# Altium schematic sheet EEPROM.SchDoc: EEPROM
size 420 x 297 mm; Author: P. Zdunek; DrawnBy: P. Zdunek; Organization: Altium Limited; Address1: L3, 12a Rodborough Rd; Address2: Frenchs Forest; Address3: NSW; Address4: Australia 2086; DocumentNumber: 16; SheetNumber: 16; SheetTotal: 37; ModifiedBy: -; CheckedDate: -; Title2: Fast Stabilizer; DivGrp: WUT ISE; Designer: G.Kasprowicz
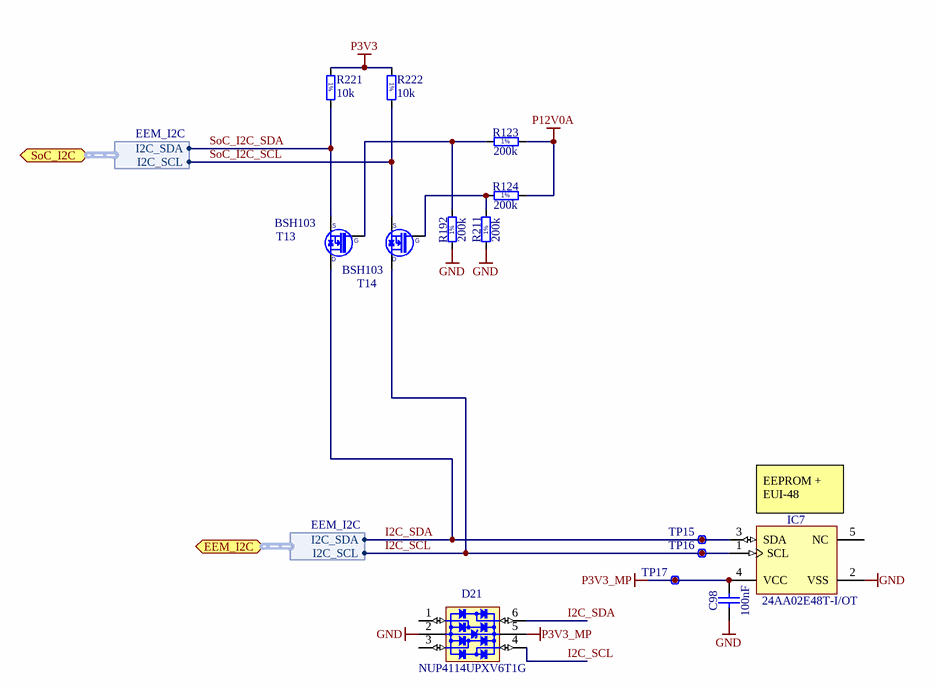
[diagram p0: EEPROM.SchDoc]

## Parts
C98  100nF  [CAPC1005X55N]
D21  NUP4114UPXV6T1G  [SOTFL50P160X60-6N]
IC7  24AA02E48T-I/OT  [SOT95P280X145-5N]
R123  200k  [RESC1005X40N]
R124  200k  [RESC1005X40N]
R192  200k  [RESC1005X40N]
R211  200k  [RESC1005X40N]
R221  10k  [RESC1005X40N]
R222  10k  [RESC1005X40N]
T13  BSH103  [SOT95P230X110-3N]
T14  BSH103  [SOT95P230X110-3N]
TP15  Test Point  [TPS127]  (value not drawn)  (no BOM)
TP16  Test Point  [TPS127]  (value not drawn)  (no BOM)
TP17  Test Point  [TPS127]  (value not drawn)  (no BOM)

## Ports
EEM_I2C (bidir, harness EEM_I2C), SoC_I2C (bidir, harness EEM_I2C)

## Harnesses
EEM_I2C: I2C_SCL, I2C_SDA

## Nets
GND: C98.1 D21.2(GND) IC7.2(VSS) R192.1 R211.1
P3V3: R221.1 R222.1
P3V3_MP: C98.2 D21.5(VBUS) IC7.4(VCC) TP17.1
P12V0A: R123.2 R124.2
I2C_SCL: D21.4(I/O3) IC7.1(SCL) T14.3(D) TP16.1 ; port EEM_I2C.I2C_SCL
I2C_SDA: D21.6(I/O4) IC7.3(SDA) T13.3(D) TP15.1 ; port EEM_I2C.I2C_SDA
SoC_I2C_SCL: R222.2 T14.2(S) ; port SoC_I2C.I2C_SCL
SoC_I2C_SDA: R221.2 T13.2(S) ; port SoC_I2C.I2C_SDA
NetR123_1: R123.1 R192.2 T13.1(G)
NetR124_1: R124.1 R211.2 T14.1(G)

Not connected (* = marked no-connect by the designer): D21 1(I/O1) 3(I/O2); IC7 5(NC)

## Notes on the sheet
- (near IC7) EEPROM + EUI-48
- Project/Equipment
- Document
- Designer
- Drawn by
- Check.by
- Copyright WUT ISE 2020.
  This documentation describes Open Hardware and is licensed under the CERN OHL v.1.2. You may redistribute and modify this documentation under the terms of the CERN OHL v.1.2. (http://ohwr.org/CERNOHL). This documentation is distributed WITHOUT ANY EXPRESS OR IMPLIED WARRANTY, INCLUDING OF MERCHANTABILITY, SATISFACTORY QUALITY AND FITNESS FOR A PARTICULAR PURPOSE. Please see the CERN OHL v.1.2 for applicable conditions.
- Contact
- File
- Last Mod.
- Print Date
- Sheet
- Size
- A3
- of
- Rev
- (in symbol R0402_10K_1%_0.0625W_100PPM) 1%
- (in symbol R0402_200K_1%_0.0625W_100PPM) 1%

## Library data of the parts
C98 = CC0402_100NF_16V_10%_X5R: Non-polarised capacitor; Part Description: SMD Multilayer Chip Ceramic Capacitor; Manufacturer: GENERIC; Manufacturer1 Part Number: GRM155R61C104KA88D; Voltage: 16V; TC: X5R; Tolerance: ±10%; Part Number: CC0402_100NF_16V_10%_X5R; Component Kind: Standard; Component Type: Standard; Pin Count: 2; Value: 100nF; Status: None; Manufacturer Part Number: CC0402_100NF_16V_10%_X5R; Case: 0402; Mounted: Yes; Socket: No; SMD: Yes; Sense: No; Manufacturer1 Example: MURATA; Manufacturer1 ComponentHeight: 0.55mm; HelpURL: \\cern.ch\dfs\Applications\Altium\Datasheets\CC0402_X5R_MURATA_GRM.pdf; Author: CERN DEM JLC; CreateDate: 10.12.2013; LatestRevisionDate: 10.12.2013
D21 = NUP4114UPXV6T1G: Part Description: ESD Protection Diodes Array (8kV) with Low Clamping Voltage; Manufacturer: ON SEMICONDUCTOR; Voltage: 5.5V; PressFit: No; Bonding: No; Part Number: NUP4114UPXV6T1G; Component Kind: Standard; Component Type: Standard; Device: NUP4114UPXV6T1G; PackageDescription: SOTFL (SOT666, SOT563,), 0.50mm, Pitch; 6 Pin, 1.20mm W X 1.60mm L X 0.60mm H Body, IPC Medium Density; Manufacturer Part Number: NUP4114UPXV6T1G; Pin Count: 8; Mounted: Yes; Socket: No; SMD: Yes; Sense: No; ComponentHeight: 1.75mm; HelpURL: \\cern.ch\dfs\Applications\Altium\Datasheets\NUP4114UPXV6T1G.pdf; Author: CERN DEM JLC; CreateDate: 05.12.2012; LatestRevisionDate: 05.12.2012
IC7 = 24AA02E48T-I/OT: 1.7V-5.5V, 2K I2C Serial EEPROM With EUI-48 Node Identity; Manufacturer: MICROCHIP TECHNOLOGY; PressFit: No; Bonding: No; Part Number: 24AA02E48T-I/OT; Component Kind: Standard; Component Type: Standard; Device: 24AA02E48T-I/OT; PackageDescription: SOT, 0.95mm pitch; 5 pin, 1.60mm W X 2.90mm L X 1.45mm H body, IPC Medium Density; Part Description: 1.7V-5.5V, 2K I2C Serial EEPROM With EUI-48 Node Identity; Manufacturer Part Number: 24AA02E48T-I/OT; Pin Count: 5; Case: SOT23-5; Mounted: Yes; Socket: No; SMD: Yes; Sense: No; ComponentHeight: 1.45mm; HelpURL: \\cern.ch\dfs\Applications\Altium\Datasheets\24AA02E48T-I-OT.pdf; Author: CERN DEM MR; CreateDate: 31.03.2016; LatestRevisionDate: 31.03.2016
R123 R124 R192 R211 = R0402_200K_1%_0.0625W_100PPM: Resistor - 1%; Part Description: General Purpose Thick Film Chip Resistor; Manufacturer: GENERIC; Manufacturer1 Part Number: 232270672004L; TC: ±100ppm/°C; PressFit: No; Part Number: R0402_200K_1%_0.0625W_100PPM; Component Kind: Standard; Component Type: Standard; Pin Count: 2; Value: 200k; Status: Not Recommended; Power: 0.0625W; Tolerance: ±1%; Manufacturer Part Number: R0402_200K_1%_0.0625W_100PPM; Case: 0402; Mounted: Yes; Sense: No; Socket: No; SMD: Yes; Manufacturer1 Example: YAGEO PHYCOMP; Manufacturer1 ComponentHeight: 0.4mm; HelpURL: \\cern.ch\dfs\Applications\Altium\Datasheets\R0402_Phycomp_RC0402.pdf; Author: CERN DEM JLC; CreateDate: 03/12/2007; LatestRevisionDate: 17/10/2012
R221 R222 = R0402_10K_1%_0.0625W_100PPM: Resistor - 1%; Part Description: General Purpose Thick Film Chip Resistor; Manufacturer: GENERIC; Manufacturer1 Part Number: 232270671003L; TC: ±100ppm/°C; Part Number: R0402_10K_1%_0.0625W_100PPM; Component Kind: Standard; Component Type: Standard; Pin Count: 2; Value: 10k; Status: Not recommended; Power: 0.0625W; Tolerance: ±1%; Manufacturer Part Number: R0402_10K_1%_0.0625W_100PPM; Case: 0402; Mounted: Yes; Sense: No; Socket: No; SMD: Yes; Manufacturer1 Example: YAGEO PHYCOMP; Manufacturer1 ComponentHeight: 0.4mm; HelpURL: \\cern.ch\dfs\Applications\Altium\Datasheets\R0402_Phycomp_RC0402.pdf; Author: CERN DEM JLC; CreateDate: 03.12.2007; LatestRevisionDate: 17.10.2012
T13 T14 = BSH103: N-CHANNEL MOSFET WITH DIODE; Part Description: 30V 850mA N-Channel Enhancement Mode Field-Effect Transistor; Manufacturer: NEXPERIA; PressFit: No; Bonding: No; Part Number: BSH103; Component Kind: Standard; Component Type: Standard; Device: BSH103; PackageDescription: SOT23, 3 pin, Pitch 0.95mm - 1.3mm W X 2.9mm L X 1.1mm H, IPC Medium Density; Manufacturer Part Number: BSH103; Pin Count: 3; Case: SOT23-3; Mounted: Yes; Socket: No; SMD: Yes; Sense: No; ComponentHeight: 1.1mm; HelpURL: \\cern.ch\dfs\Applications\Altium\Datasheets\BSH103.pdf; Author: CERN DEM JLC; CreateDate: 16.03.2010; LatestRevisionDate: 20.06.2017; ClassName: Artix
TP15-TP17 = SMD_PAD_1.27X1.27MM: Part Description: 1.27mm x 1.27mm PCB Copper Area (SMD Test Point); Mounted: No; Part Number: SMD_PAD_1.27X1.27MM; Component Type: Standard (No BOM); Pin Count: 1; Family: Test Point; Socket: No; SMD: Yes; Sense: No; Status: None; ComponentHeight: 0mm; HelpURL: Undefined; Author: CERN DEM JLC; CreateDate: 12.01.2008; LatestRevisionDate: 12.01.2008; PackageDescription: 1.27mm x 1.27mm PCB Copper Area (SMD Test Point)